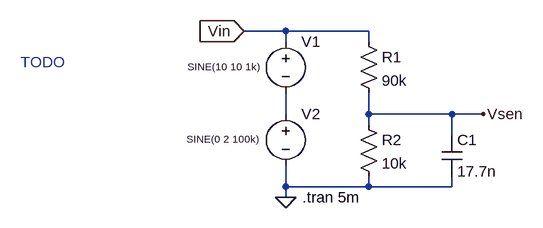
[diagram p0: schematic RC Filter to Filter Out 100KHz Noise.asc]
RC Filter to Filter Out 100KHz Noise.asc, the LTspice schematic file:
Version 4
SHEET 1 1564 680
WIRE 400 192 336 192
WIRE 528 192 400 192
WIRE 400 208 400 192
WIRE 528 208 528 192
WIRE 400 320 400 288
WIRE 528 320 528 288
WIRE 656 320 528 320
WIRE 704 320 656 320
WIRE 528 336 528 320
WIRE 656 352 656 320
WIRE 400 432 400 400
WIRE 528 432 528 416
WIRE 528 432 400 432
WIRE 656 432 656 416
WIRE 656 432 528 432
WIRE 400 448 400 432
FLAG 400 448 0
FLAG 336 192 Vin
IOPIN 336 192 In
FLAG 704 320 Vsen
SYMBOL voltage 400 192 R0
WINDOW 39 0 0 Left 2
WINDOW 3 -151 55 Left 1
WINDOW 123 0 0 Left 0
SYMATTR Value SINE(10 10 1k)
SYMATTR InstName V1
SYMBOL res 512 192 R0
SYMATTR InstName R1
SYMATTR Value 90k
SYMBOL voltage 400 304 R0
WINDOW 3 -153 54 Left 1
WINDOW 123 0 0 Left 0
WINDOW 39 0 0 Left 0
SYMATTR InstName V2
SYMATTR Value SINE(0 2 100k)
SYMBOL res 512 320 R0
SYMATTR InstName R2
SYMATTR Value 10k
SYMBOL cap 640 352 R0
SYMATTR InstName C1
SYMATTR Value 17.7n
TEXT 426 448 Left 2 !.tran 5m
TEXT -8 240 Left 2 ;TODO

The netlist it stands for:
* RC Filter to Filter Out 100KHz Noise.asc
V1 Vin N001 SINE(10 10 1k)
R1 Vin Vsen 90k
V2 N001 0 SINE(0 2 100k)
R2 Vsen 0 10k
C1 Vsen 0 17.7n
.tran 5m
* TODO
.backanno
.end